# Altium schematic sheet STM32F103最小系统板.SchDoc
size A3
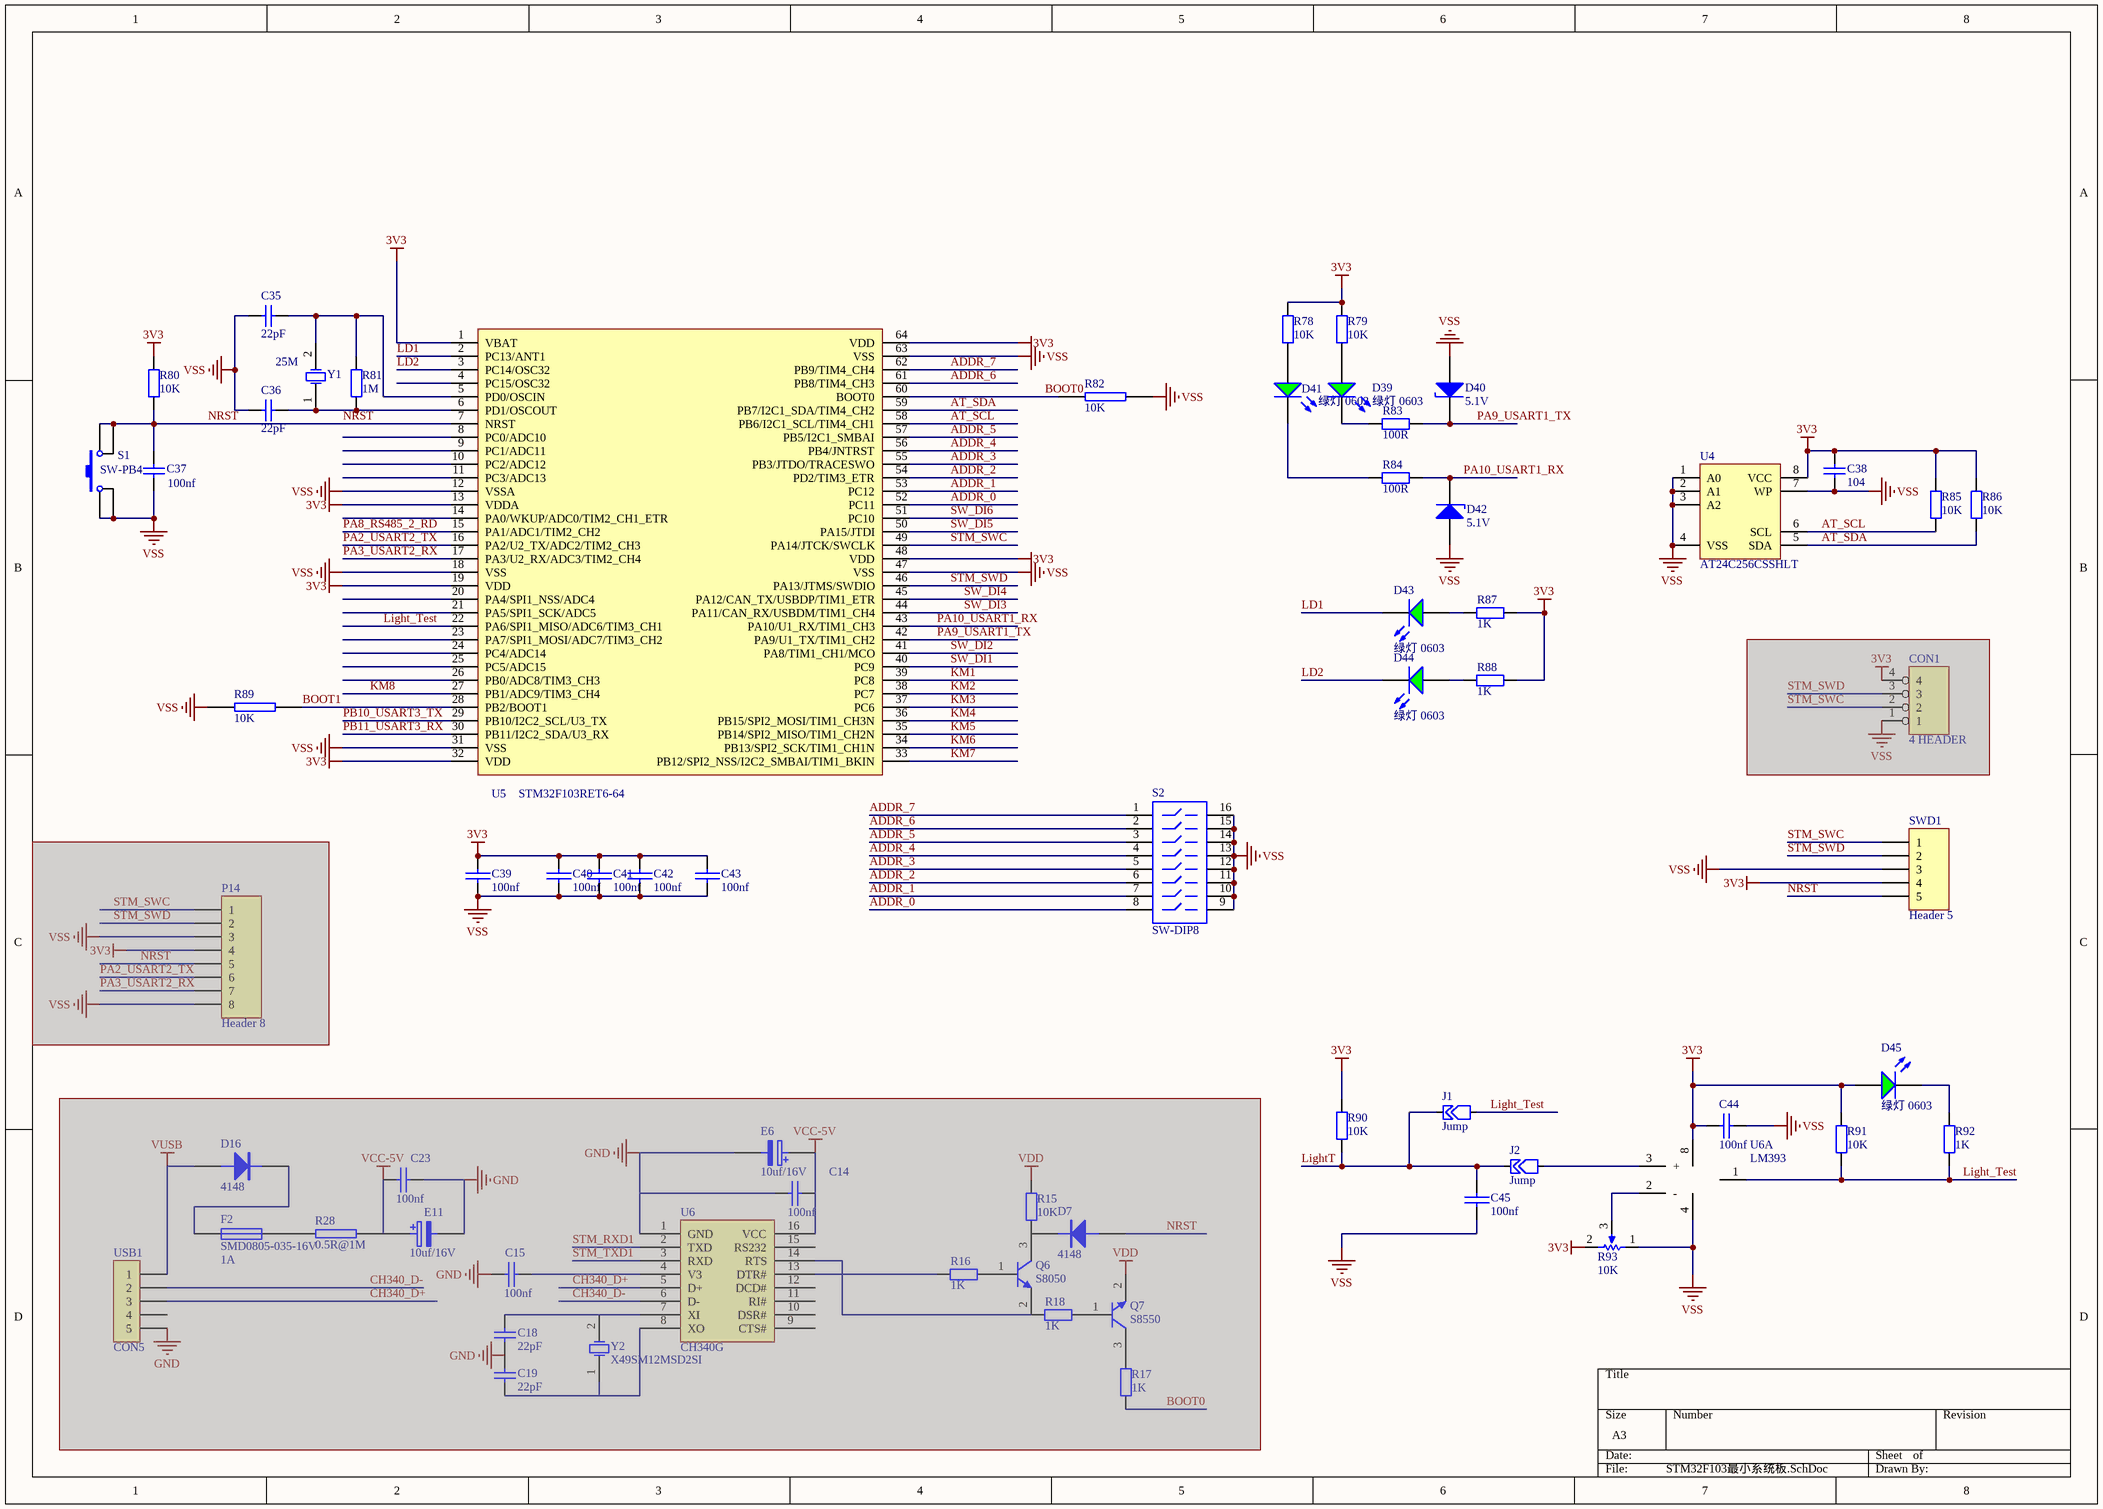
[diagram p0: STM32F103最小系统板.SchDoc]

## Parts
(Parts that share a designator on the sheet are numbered #1, #2 ... from top to bottom, then left to right.)
C14  100nf  [LC-0603_C]  (masked out: inside a compile mask, not in the netlist)
C15  100nf  [LC-0603_C]  (masked out: inside a compile mask, not in the netlist)
C18  22pF  [LC-0603_C]  (masked out: inside a compile mask, not in the netlist)
C19  22pF  [LC-0603_C]  (masked out: inside a compile mask, not in the netlist)
C23  100nf  [LC-0603_C]  (masked out: inside a compile mask, not in the netlist)
C35  22pF  [LC-0603_C]
C36  22pF  [LC-0603_C]
C37  100nf  [LC-0603_C]
C38  104  [LC-0603_C]
C39  100nf  [LC-0603_C]
C40  100nf  [LC-0603_C]
C41  100nf  [LC-0603_C]
C42  100nf  [LC-0603_C]
C43  100nf  [LC-0603_C]
C44  100nf  [LC-0603_C]
C45  100nf  [LC-0603_C]
CON1  4 HEADER  [sip4]  (masked out: inside a compile mask, not in the netlist)
D7  4148  [LC-LL-34]  (masked out: inside a compile mask, not in the netlist)
D16  4148  [LC-LL-34]  (masked out: inside a compile mask, not in the netlist)
D39  绿灯 0603  [0603_LED_G]
D40  value 5.1V  [D-1206]  (hidden comment: Diode-Z)
D41  绿灯 0603  [0603_LED_G]
D42  value 5.1V  [D-1206]  (hidden comment: Diode-Z)
D43  绿灯 0603  [LC-0603_LED_S1]
D44  绿灯 0603  [LC-0603_LED_S1]
D45  绿灯 0603  [0603_LED_G]
E6  10uf/16V  [LC-CASE-A_3216]  (masked out: inside a compile mask, not in the netlist)
E11  10uf/16V  [LC-CASE-A_3216]  (masked out: inside a compile mask, not in the netlist)
F2  SMD0805-035-16V  value 1A  [LC-0805_R]  (masked out: inside a compile mask, not in the netlist)
J1  Jump  [JT]
J2  Jump  [JT]
P14  Header 8  [HDR1X8]  (masked out: inside a compile mask, not in the netlist)
Q6  S8050  [LC-SOT-23(SOT-23-3)]  (masked out: inside a compile mask, not in the netlist)
Q7  S8550  [LC-SOT-23(SOT-23-3)]  (masked out: inside a compile mask, not in the netlist)
R15  10K  [LC-0603_R]  (masked out: inside a compile mask, not in the netlist)
R16  1K  [LC-0603_R]  (masked out: inside a compile mask, not in the netlist)
R17  1K  [LC-0603_R]  (masked out: inside a compile mask, not in the netlist)
R18  1K  [LC-0603_R]  (masked out: inside a compile mask, not in the netlist)
R28  0.5R@1M  [LC-0805_R]  (masked out: inside a compile mask, not in the netlist)
R78  10K  [LC-0603_R]
R79  10K  [LC-0603_R]
R80  10K  [LC-0603_R]
R81  1M  [LC-0603_R]
R82  10K  [LC-0603_R]
R83  value 100R  [LC-0603_R]  (hidden comment: 1K)
R84  value 100R  [LC-0603_R]  (hidden comment: 1K)
R85  10K  [LC-0603_R]
R86  10K  [LC-0603_R]
R87  1K  [LC-0603_R]
R88  1K  [LC-0603_R]
R89  10K  [LC-0603_R]
R90  value 10K  [LC-0603_R]  (hidden comment: 1K)
R91  value 10K  [LC-0603_R]  (hidden comment: 1K)
R92  1K  [LC-0603_R]
R93  10K  [3296W]
S1  SW-PB4  [SW_PB4_A1]
S2  SW-DIP8  [SW-DIP8]
SWD1  Header 5  [SWD-5]
U4  AT24C256CSSHLT  [SOIC-8]
U5  STM32F103RET6-64  [LC-LQFP-64_10x10x05P]
U6#1  LM393  [sop-8]  (part A of 2)
U6#2  CH340G  [LC-SOIC-16_150mil]
USB1  CON5  [USB_MICRO]  (masked out: inside a compile mask, not in the netlist)
Y1  25M  [LC-SMD-5032_2P]
Y2  X49SM12MSD2SI  [LC-HC-49SMD]  (masked out: inside a compile mask, not in the netlist)

## Nets
3V3: C38.1 C39.2 C40.2 C41.2 C42.2 C43.2 C44.2 D45.A R78.1 R79.1 R80.2 R85.1 R86.1 R87.1 R88.1 R90.1 R91.1 R93.2(BOT) SWD1.4 U4.8(VCC) U5.1(VBAT) U5.13(VDDA) U5.19(VDD) U5.32(VDD) U5.48(VDD) U5.64(VDD) U6#1.8(VCC)
VSS: C35.1 C36.1 C37.1 C38.2 C39.1 C40.1 C41.1 C42.1 C43.1 C44.1 C45.1 D40.1(A) D42.1(A) R82.1 R89.1 R93.1(TOP) S1.1 S1.4 S2.9 S2.10 S2.11 S2.12 S2.13 S2.14 S2.15 S2.16 SWD1.3 U4.1(A0) U4.2(A1) U4.3(A2) U4.4(VSS) U4.7(WP) U5.12(VSSA) U5.18(VSS) U5.31(VSS) U5.47(VSS) U5.63(VSS) U6#1.4(GND)
ADDR_0: S2.8 U5.52(PC11)
ADDR_1: S2.7 U5.53(PC12)
ADDR_2: S2.6 U5.54(PD2/TIM3_ETR)
ADDR_3: S2.5 U5.55(PB3/JTDO/TRACESWO)
ADDR_4: S2.4 U5.56(PB4/JNTRST)
ADDR_5: S2.3 U5.57(PB5/I2C1_SMBAI)
ADDR_6: S2.2 U5.61(PB8/TIM4_CH3)
ADDR_7: S2.1 U5.62(PB9/TIM4_CH4)
AT_SCL: R85.2 U4.6(SCL) U5.58(PB6/I2C1_SCL/TIM4_CH1)
AT_SDA: R86.2 U4.5(SDA) U5.59(PB7/I2C1_SDA/TIM4_CH2)
BOOT0: R82.2 U5.60(BOOT0)
BOOT1: R89.2 U5.28(PB2/BOOT1)
KM1: U5.39(PC8)
KM2: U5.38(PC7)
KM3: U5.37(PC6)
KM4: U5.36(PB15/SPI2_MOSI/TIM1_CH3N)
KM5: U5.35(PB14/SPI2_MISO/TIM1_CH2N)
KM6: U5.34(PB13/SPI2_SCK/TIM1_CH1N)
KM7: U5.33(PB12/SPI2_NSS/I2C2_SMBAI/TIM1_BKIN)
KM8: U5.27(PB1/ADC9/TIM3_CH4)
LD1: D43.K U5.2(PC13/ANT1)
LD2: D44.K U5.3(PC14/OSC32)
Light_Test: J1.2(GND) R91.2 R92.2 U5.22(PA6/SPI1_MISO/ADC6/TIM3_CH1) U6#1.1(out)
LightT: C45.2 J1.1(GND) J2.1(GND) R90.2
NRST: C37.2 R80.1 S1.2 S1.3 SWD1.5 U5.7(NRST)
PA2_USART2_TX: U5.16(PA2/U2_TX/ADC2/TIM2_CH3)
PA3_USART2_RX: U5.17(PA3/U2_RX/ADC3/TIM2_CH4)
PA8_RS485_2_RD: U5.15(PA1/ADC1/TIM2_CH2)
PA9_USART1_TX: D40.2(K) R83.1 U5.42(PA9/U1_TX/TIM1_CH2)
PA10_USART1_RX: D42.2(K) R84.1 U5.43(PA10/U1_RX/TIM1_CH3)
PB10_USART3_TX: U5.29(PB10/I2C2_SCL/U3_TX)
PB11_USART3_RX: U5.30(PB11/I2C2_SDA/U3_RX)
STM_SWC: SWD1.1 U5.49(PA14/JTCK/SWCLK)
STM_SWD: SWD1.2 U5.46(PA13/JTMS/SWDIO)
SW_DI1: U5.40(PC9)
SW_DI2: U5.41(PA8/TIM1_CH1/MCO)
SW_DI3: U5.44(PA11/CAN_RX/USBDM/TIM1_CH4)
SW_DI4: U5.45(PA12/CAN_TX/USBDP/TIM1_ETR)
SW_DI5: U5.50(PA15/JTDI)
SW_DI6: U5.51(PC10)
NetC35_2: C35.2 R81.2 U5.5(PD0/OSCIN) Y1.2(OSC2)
NetC36_2: C36.2 R81.1 U5.6(PD1/OSCOUT) Y1.1(OSC1)
NetD39_A: D39.A R79.2
NetD39_K: D39.K R83.2
NetD41_A: D41.A R78.2
NetD41_K: D41.K R84.2
NetD43_A: D43.A R87.2
NetD44_A: D44.A R88.2
NetD45_K: D45.K R92.1
NetJ2_2: J2.2(GND) U6#1.3(+)
NetR93_3: R93.3(TAP) U6#1.2(-)

Not connected (* = marked no-connect by the designer): U5 4(PC15/OSC32) 8(PC0/ADC10) 9(PC1/ADC11) 10(PC2/ADC12) 11(PC3/ADC13) 14(PA0/WKUP/ADC0/TIM2_CH1_ETR) 20(PA4/SPI1_NSS/ADC4) 21(PA5/SPI1_SCK/ADC5) 23(PA7/SPI1_MOSI/ADC7/TIM3_CH2) 24(PC4/ADC14) 25(PC5/ADC15) 26(PB0/ADC8/TIM3_CH3); U6#2 1(GND) 2(TXD) 3(RXD) 4(V3) 5(D+) 6(D-) 7(XI) 8(XO) 9(CTS#) 10(DSR#) 11(RI#) 12(DCD#) 13(DTR#) 14(RTS) 15(RS232) 16(VCC)

## Library data of the parts
C14 C15 C23 C39-C45 = CAP: Capacitor
C18 C19 C35 C36 = Cap: Capacitor; Published: 8-Jun-2000; LatestRevisionDate: 17-Jul-2002; LatestRevisionNote: Re-released for DXP Platform.; PackageReference: RAD-0.3; Publisher: Altium Limited; Value: 22pF
C37 = Cap: Capacitor; Value: 0.1uF; Published: 8-Jun-2000; LatestRevisionDate: 17-Jul-2002; LatestRevisionNote: Re-released for DXP Platform.; PackageReference: RAD-0.3; Publisher: Altium Limited
C38 = CAP: Capacitor; Value: 100nF; Published: 8-Jun-2000; Revision: July-2002: Re-released for DXP Platform.; Publisher: Altium Limited
CON1 = 4 HEADER: 4 Pin Header
D7 D16 = DIODE
D39 D41 D43-D45 = 0: 发光二极管; ComponentLink1Description: 供应商链接; ComponentLink1URL: http://www.szlcsc.com/product/details_73152.html; Package: 0603; Supplier: LC; SuppliersPartNumber: C72043
D40 D42 = Diode-Z: 稳压二极管; Published: 8-Jun-2000; LatestRevisionDate: 17-Jul-2002; LatestRevisionNote: Re-released for DXP Platform.; PackageReference: SMB; Publisher: Altium Limited; Code_JEDEC: DO-214-AA
E6 E11 = ELECTRO2: Electrolytic Capacitor
F2 = F: 保险丝
P14 = Header 8: Header, 8-Pin; LatestRevisionDate: 17-Jul-2002; LatestRevisionNote: Re-released for DXP Platform.; Publisher: Altium Limited
Q7 = S8050
R15 R78-R80 R85 R86 = Res2: Resistor; Published: 8-Jun-2000; LatestRevisionDate: 17-Jul-2002; LatestRevisionNote: Re-released for DXP Platform.; PackageReference: AXIAL-0.4; Publisher: Altium Limited; Value: 10K
R16-R18 R81 = Res2: Resistor; Value: 10K; Published: 8-Jun-2000; LatestRevisionDate: 17-Jul-2002; LatestRevisionNote: Re-released for DXP Platform.; PackageReference: AXIAL-0.4; Publisher: Altium Limited
R28 R82 R89 = RES2
R83 R84 R87 R88 R90-R92 = R: 贴片电阻; Published: 8-Jun-2000; LatestRevisionDate: 17-Jul-2002; LatestRevisionNote: Re-released for DXP Platform.; PackageReference: AXIAL-0.4; Publisher: Altium Limited
  R87 R88 R92: Value: 1K
R93 = RPot: Potentiometer; Sim Note: Enter the Resistance value and the set point into parameter fields.; Set Position: 0.5; Published: 8-Jun-2000; LatestRevisionDate: 17-Jul-2002; LatestRevisionNote: Re-released for DXP Platform.; PackageReference: VR5; Publisher: Altium Limited; PackageDescription: Variable Resistor, Thru-Hole; 3 Leads; Value: 10K
S1 = SW-: 微动开关; Published: 24-Mar-1999; LatestRevisionDate: 17-Jul-2002; LatestRevisionNote: Re-released for DXP Platform.; PackageReference: SPST-2; Publisher: Altium Limited
S2 = SW-DIP8: 4009 Series DIP Switch, Raised actuator; Published: 24-Mar-1999; LatestRevisionDate: 17-Dec-2003; LatestRevisionNote: PCB Footprint replaced.; PackageReference: DIP-16-KEY; Publisher: Altium Limited; PackageDescription: DIP; 16 Leads; Row Spacing 7.62 mm; Pitch 2.54 mm; ComponentLink1Description: Manufacturer Link; ComponentLink1URL: http://www.oupiin.com/prodindx.html#Headers
SWD1 = Header 5: Header, 5-Pin; LatestRevisionDate: 17-Jul-2002; LatestRevisionNote: Re-released for DXP Platform.; Publisher: Altium Limited
U4 = AT24C02: EEROM存储器
U5 = STM32F103RBT6
USB1 = CON5: Connector
Y1 Y2 = XTAL: Crystal Oscillator; Published: 8-Jun-2000; LatestRevisionDate: 17-Jul-2002; LatestRevisionNote: Re-released for DXP Platform.; PackageReference: R38; Publisher: Altium Limited